# EAGLE design FloppyController1A (EAGLE 7.3.0)
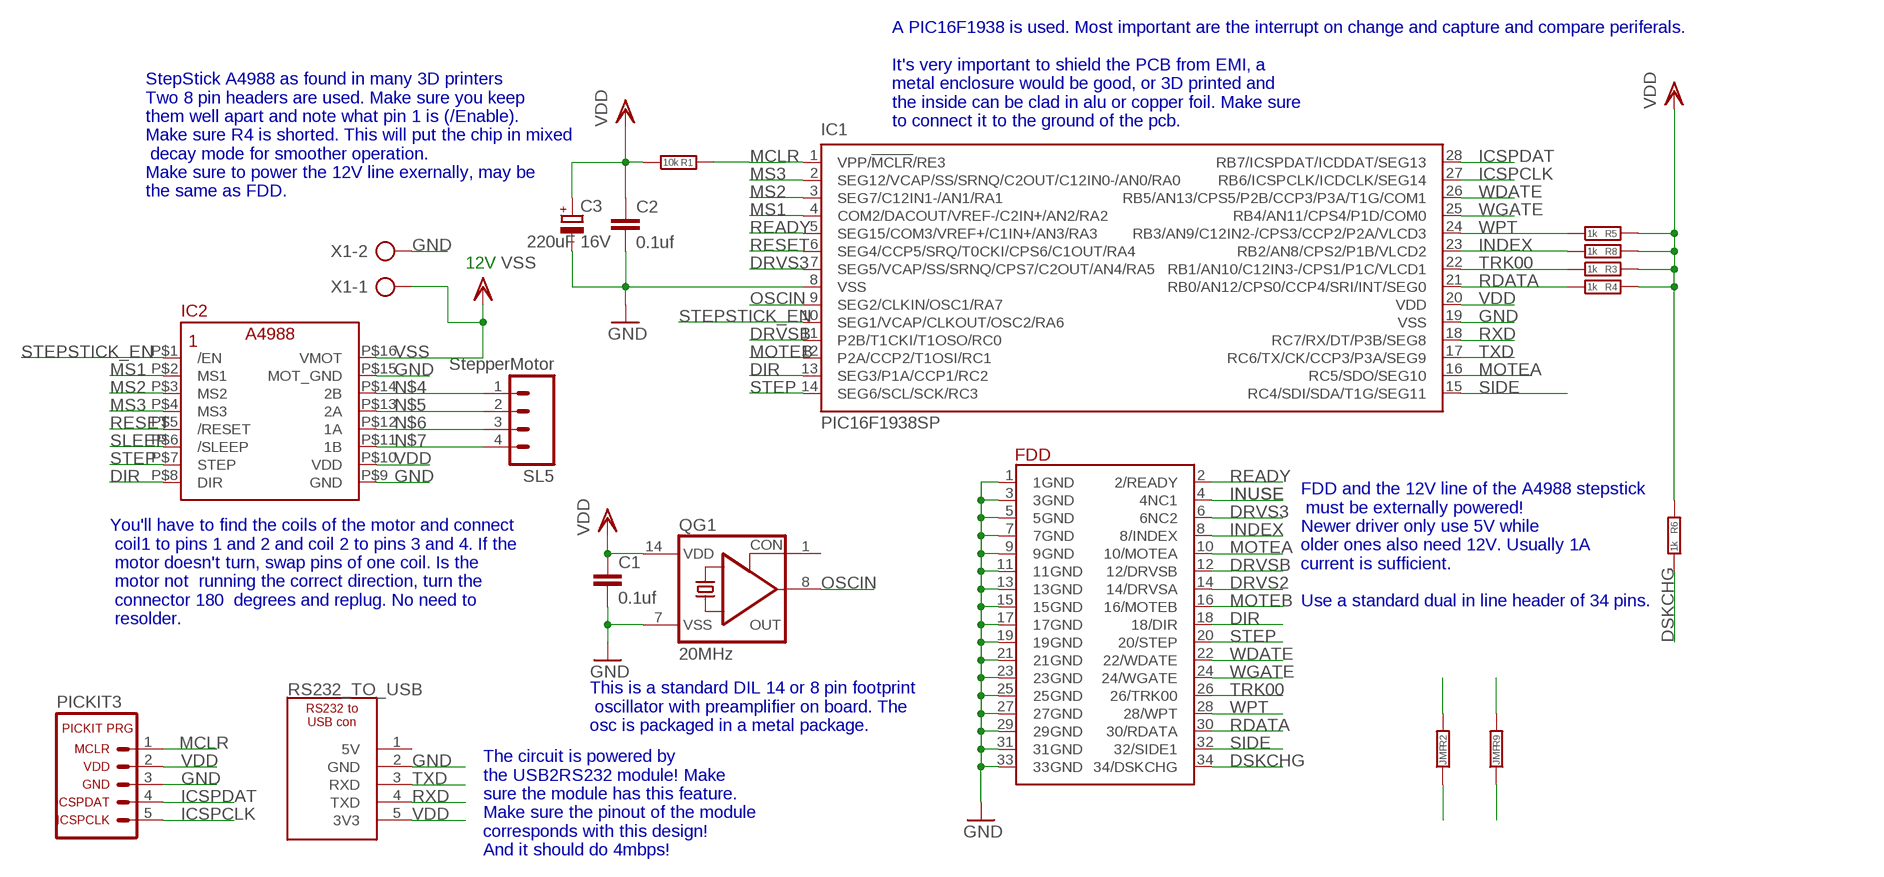
[diagram p0: schematic, sheet 1]

## Parts
C1  0.1uf  C-EUC0805BOTTOM  [C0805TOP]
C2  0.1uf  C-EUC0805BOTTOM  [C0805TOP]
C3  220uF 16V  CPOL-EUE2.5-6  [E2,5-6]
FDD  FLOPPY_34PIN_CONN  [FLOPPY_34PIN_DUALROW]
IC1  PIC16F1938SP  [DIL28-3]
IC2  STEPSTICK_A4988  [STEPSTICK_A4988]
PICKIT3  PICKIT3CONNECTOR  [05P]
QG1  20MHz  CRYSTAL_RES-SG51  [SG51]
R1  10k  R-EU_M1206  [M1206]
R2  JMP  R-EU_M1206  [M1206]
R3  1k  R-EU_M1206  [M1206]
R4  1k  R-EU_M1206  [M1206]
R5  1k  R-EU_M1206  [M1206]
R6  1k  R-EU_M1206  [M1206]
R8  1k  R-EU_M1206  [M1206]
R9  JMP  R-EU_M1206  [M1206]
RS232_TO_USB  RS232_TO_USB_CONNECTOR  [05P]
SL5  StepperMotor  M04  [04P]
X1  AK500/2-H  [AK500/2-H]

## Nets
DIR: FDD.18(18/DIR) IC1.13(SEG3/P1A/CCP1/RC2) IC2.P$8(DIR)
DRVS2: FDD.14(14/DRVSA)
DRVS3: FDD.6(6NC2) IC1.7(SEG5/VCAP/SS/SRNQ/CPS7/C2OUT/AN4/RA5)
DRVSB: FDD.12(12/DRVSB) IC1.11(P2B/T1CKI/T1OSO/RC0)
DSKCHG: FDD.34(34/DSKCHG) R6.1
GND: C1.2 C2.2 C3.- FDD.1(1GND) FDD.3(3GND) FDD.5(5GND) FDD.7(7GND) FDD.9(9GND) FDD.11(11GND) FDD.13(13GND) FDD.15(15GND) FDD.17(17GND) FDD.19(19GND) FDD.21(21GND) FDD.23(23GND) FDD.25(25GND) FDD.27(27GND) FDD.29(29GND) FDD.31(31GND) FDD.33(33GND) IC1.8(VSS) IC1.19(VSS) IC2.P$9(GND) IC2.P$15(MOT_GND) PICKIT3.3(3_GND) QG1.7(VSS) R9.1 R9.2 RS232_TO_USB.2(GND) X1.2
ICSPCLK: IC1.27(RB6/ICSPCLK/ICDCLK/SEG14) PICKIT3.5(5_ICSPCLK)
ICSPDAT: IC1.28(RB7/ICSPDAT/ICDDAT/SEG13) PICKIT3.4(4_ICSPDAT)
INDEX: FDD.8(8/INDEX) IC1.23(RB2/AN8/CPS2/P1B/VLCD2) R8.1
INUSE: FDD.4(4NC1)
MCLR: IC1.1(VPP/!MCLR!/RE3) PICKIT3.1(1_MCLR) R1.2
MOTEA: FDD.10(10/MOTEA) IC1.16(RC5/SDO/SEG10) R2.1 R2.2
MOTEB: FDD.16(16/MOTEB) IC1.12(P2A/CCP2/T1OSI/RC1)
MS1: IC1.4(COM2/DACOUT/VREF-/C2IN+/AN2/RA2) IC2.P$2(MS1)
MS2: IC1.3(SEG7/C12IN1-/AN1/RA1) IC2.P$3(MS2)
MS3: IC1.2(SEG12/VCAP/SS/SRNQ/C2OUT/C12IN0-/AN0/RA0) IC2.P$4(MS3)
N$4: IC2.P$14(2B) SL5.1
N$5: IC2.P$13(2A) SL5.2
N$6: IC2.P$12(1A) SL5.3
N$7: IC2.P$11(1B) SL5.4
OSCIN: IC1.9(SEG2/CLKIN/OSC1/RA7) QG1.8(OUT)
RDATA: FDD.30(30/RDATA) IC1.21(RB0/AN12/CPS0/CCP4/SRI/INT/SEG0) R4.1
READY: FDD.2(2/READY) IC1.5(SEG15/COM3/VREF+/C1IN+/AN3/RA3)
RESET: IC1.6(SEG4/CCP5/SRQ/T0CKI/CPS6/C1OUT/RA4) IC2.P$5(/RESET)
RXD: IC1.18(RC7/RX/DT/P3B/SEG8) RS232_TO_USB.4(TXD)
SIDE: FDD.32(32/SIDE1) IC1.15(RC4/SDI/SDA/T1G/SEG11)
SLEEP: IC2.P$6(/SLEEP)
STEP: FDD.20(20/STEP) IC1.14(SEG6/SCL/SCK/RC3) IC2.P$7(STEP)
STEPSTICK_EN: IC1.10(SEG1/VCAP/CLKOUT/OSC2/RA6) IC2.P$1(/EN)
TRK00: FDD.26(26/TRK00) IC1.22(RB1/AN10/C12IN3-/CPS1/P1C/VLCD1) R3.1
TXD: IC1.17(RC6/TX/CK/CCP3/P3A/SEG9) RS232_TO_USB.3(RXD)
VDD: C1.1 C2.1 C3.+ IC1.20(VDD) IC2.P$10(VDD) PICKIT3.2(2_VDD) QG1.14(VDD) R1.1 R3.2 R4.2 R5.2 R6.2 R8.2 RS232_TO_USB.5(3V3)
VSS: IC2.P$16(VMOT) X1.1
WDATE: FDD.22(22/WDATE) IC1.26(RB5/AN13/CPS5/P2B/CCP3/P3A/T1G/COM1)
WGATE: FDD.24(24/WGATE) IC1.25(RB4/AN11/CPS4/P1D/COM0)
WPT: FDD.28(28/WPT) IC1.24(RB3/AN9/C12IN2-/CPS3/CCP2/P2A/VLCD3) R5.1
Unconnected: QG1.1(CON) RS232_TO_USB.1(5V)

## Notes on the sheet
- A PIC16F1938 is used. Most important are the interrupt on change and capture and compare periferals.
  
  It's very important to shield the PCB from EMI, a
  metal enclosure would be good, or 3D printed and
  the inside can be clad in alu or copper foil. Make sure 
  to connect it to the ground of the pcb.
- StepStick A4988 as found in many 3D printers
  Two 8 pin headers are used. Make sure you keep
  them well apart and note what pin 1 is (/Enable).
  Make sure R4 is shorted. This will put the chip in mixed
   decay mode for smoother operation.
  Make sure to power the 12V line exernally, may be 
  the same as FDD.
- 12V
- FDD and the 12V line of the A4988 stepstick
   must be externally powered!
  Newer driver only use 5V while
  older ones also need 12V. Usually 1A
  current is sufficient. 
  
  Use a standard dual in line header of 34 pins.
- You'll have to find the coils of the motor and connect
   coil1 to pins 1 and 2 and coil 2 to pins 3 and 4. If the
   motor doesn't turn, swap pins of one coil. Is the
   motor not  running the correct direction, turn the
   connector 180  degrees and replug. No need to
   resolder.
- This is a standard DIL 14 or 8 pin footprint
   oscillator with preamplifier on board. The 
  osc is packaged in a metal package.
- The circuit is powered by
  the USB2RS232 module! Make
  sure the module has this feature.
  Make sure the pinout of the module
  corresponds with this design!
  And it should do 4mbps!

## Library data of the parts
C1 C2 = _MyComponents:C-EU: CAPACITOR, European symbol
C3 = _MyComponents:CPOL-EU: POLARIZED CAPACITOR, European symbol
FDD = _MyComponents:FLOPPY_34PIN_CONN
IC1 = microchip:PIC16F19*: Flash-Based, 8-Bit CMOS Microcontrollers wtih LCD Driver and nanoWatt XLP Technology Auto generated by make-symbol-device-package-bsdl.ulp Rev. 33 Source: http://ww1.microchip.com/downloads/en/DeviceDoc/41364D.pdf; MPN: PIC16F1938-I/SP; OC_FARNELL: 1755829; OC_NEWARK: 08R1949
IC2 = _MyComponents:STEPSTICK_A4988
PICKIT3 = _MyComponents:PICKIT3CONNECTOR: PICKIT3 Programmer CONNECTOR; OC_FARNELL: unknown; OC_NEWARK: unknown
QG1 = crystal:CRYSTAL_RES-: CRYSTAL RESONATOR; OC_FARNELL: unknown; OC_NEWARK: unknown
R1-R6 R8 R9 = rcl:R-EU_: RESISTOR, European symbol
RS232_TO_USB = _MyComponents:RS232_TO_USB_CONNECTOR
SL5 = con-amp-quick:M04: AMP QUICK CONNECTOR; OC_FARNELL: unknown; OC_NEWARK: unknown
X1 = con-ptr500:AK500/2-H: CONNECTOR Aug. 2004 / PTR Meßtechnik: Die Bezeichnung der Serie AK505 wurde geändert. Es handelt sich hierbei um AK500 in horizontaler Ausführung.; OC_FARNELL: unknown; OC_NEWARK: unknown

## Board
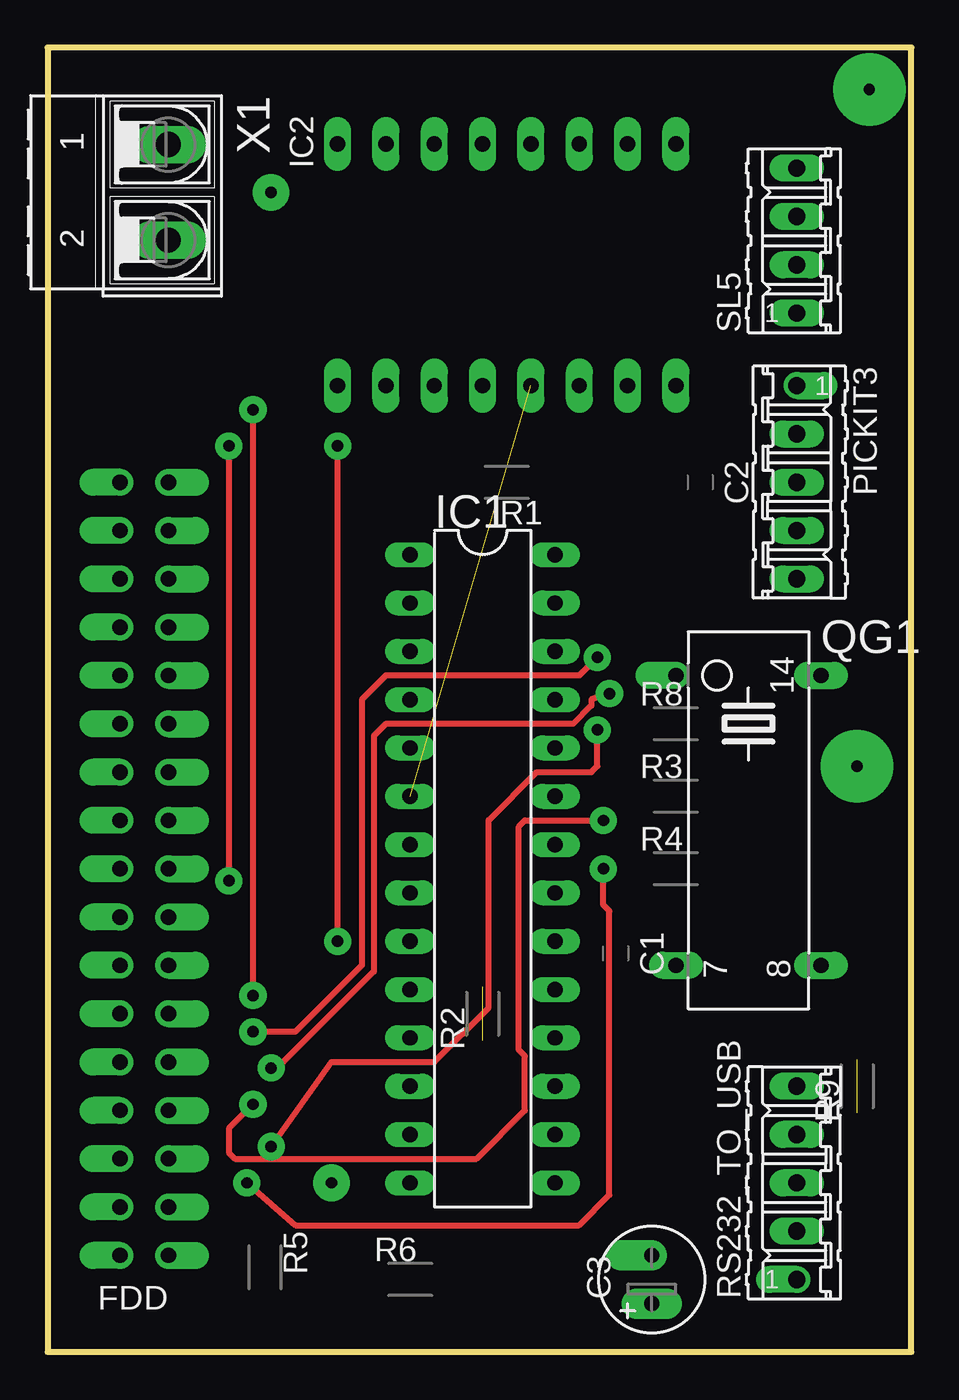
[diagram p1: board, top side]
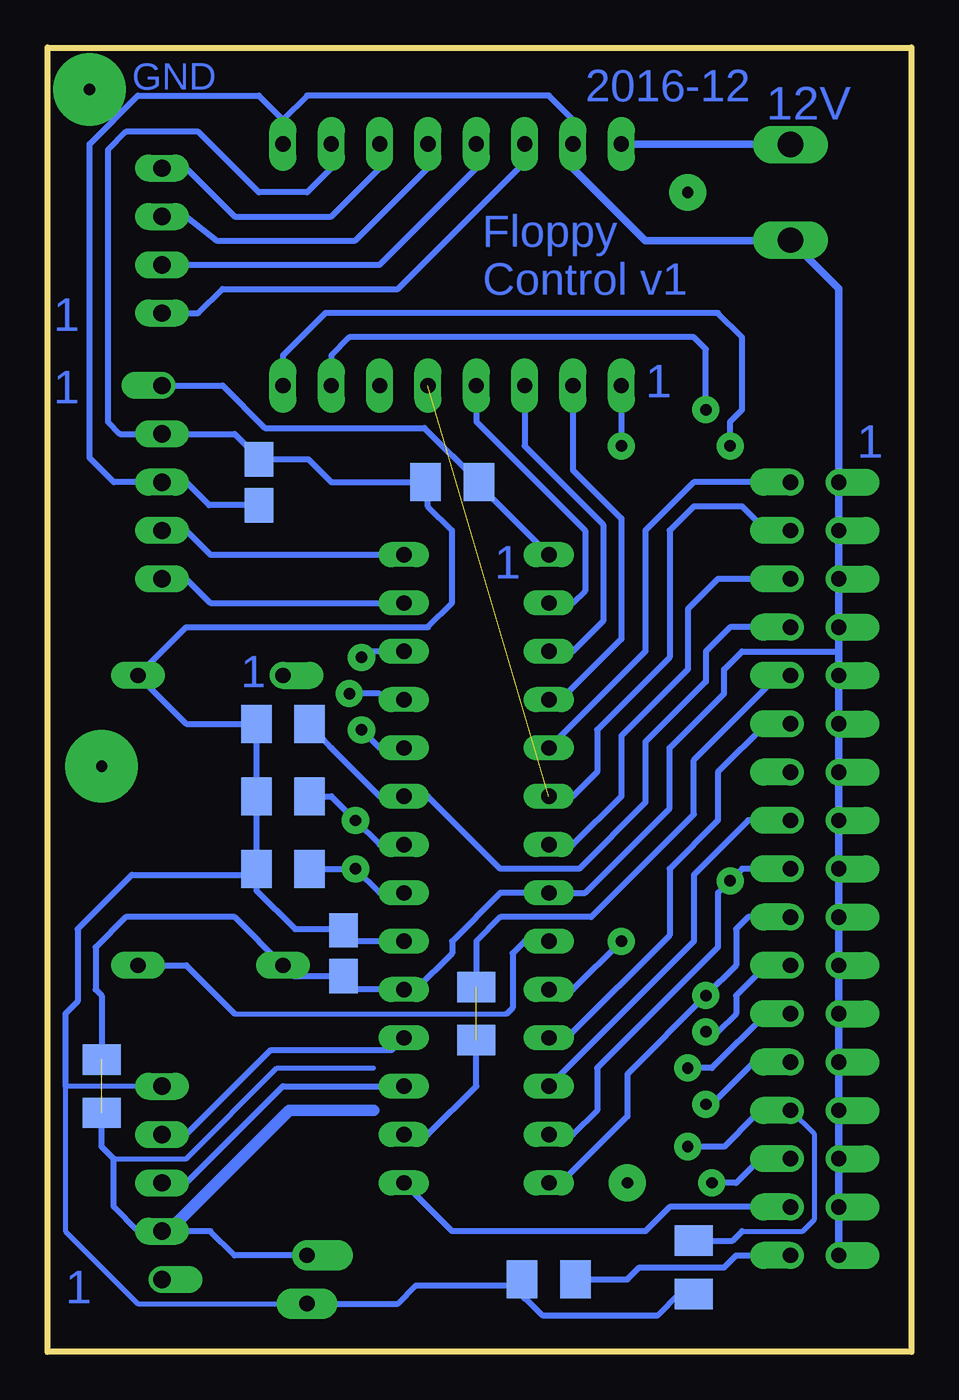
[diagram p2: board, bottom side, seen from below]

Size 45.39 x 68.57 mm. Coordinates in mm from the lower left corner, seen from the top.
Outline: 0,0 45.39,0 45.39,68.57 0,68.57 0,0
Copper layers (1*16): Top 0.035mm / dielectric 1.5mm / Bottom 0.035mm
Design rules "default": minimum track width 14mil, minimum drill 24mil, track to track 14mil, track to pad 14mil, pad to pad 14mil, via to via 14mil, smd to smd 14mil, copper to edge 40mil, drill to drill 8mil, minimum pad ring 10mil, minimum via ring 8mil, stop-mask expansion 4mil, vias tented up to drill 0mil, thermal gap 10mil

### Footprints (pad centres in the part's own frame; a part is rotated, then mirrored left to right if it is on the bottom)
C0805TOP = smd 1.808 x 1.5 bottom: 1 -1.204,0; 2 1.204,0
E2,5-6 = drill 0.813 pad 1.6 long: + -1.27,0 | drill 0.813 pad 1.6 offset: - 1.27,0
FLOPPY_34PIN_DUALROW = drill 0.8 pad 1.422 offset: 1 0,0; 2 2.54,0; 3 0,-2.54; 4 2.54,-2.54; 5 0,-5.08; 6 2.54,-5.08; 7 0,-7.62; 8 2.54,-7.62; 9 0,-10.16; 10 2.54,-10.16; 11 0,-12.7; 12 2.54,-12.7; 13 0,-15.24; 14 2.54,-15.24; 15 0,-17.78; 16 2.54,-17.78; 17 0,-20.32; 18 2.54,-20.32; 19 0,-22.86; 20 2.54,-22.86; 21 0,-25.4; 22 2.54,-25.4; 23 0,-27.94; 24 2.54,-27.94; 25 0,-30.48; 26 2.54,-30.48; 27 0,-33.02; 28 2.54,-33.02; 29 0,-35.56; 30 2.54,-35.56; 31 0,-38.1; 32 2.54,-38.1; 33 0,-40.64; 34 2.54,-40.64
DIL28-3 = drill 0.813 long: 1 -16.51,-3.81; 2 -13.97,-3.81; 3 -11.43,-3.81; 4 -8.89,-3.81; 5 -6.35,-3.81; 6 -3.81,-3.81; 7 -1.27,-3.81; 8 1.27,-3.81; 9 3.81,-3.81; 10 6.35,-3.81; 11 8.89,-3.81; 12 11.43,-3.81; 13 13.97,-3.81; 14 16.51,-3.81; 15 16.51,3.81; 16 13.97,3.81; 17 11.43,3.81; 18 8.89,3.81; 19 6.35,3.81; 20 3.81,3.81; 21 1.27,3.81; 22 -1.27,3.81; 23 -3.81,3.81; 24 -6.35,3.81; 25 -8.89,3.81; 26 -11.43,3.81; 27 -13.97,3.81; 28 -16.51,3.81
STEPSTICK_A4988 = drill 0.8 pad 1.422 long: P$1 0,0; P$2 0,-2.54; P$3 0,-5.08; P$4 0,-7.62; P$5 0,-10.16; P$6 0,-12.7; P$7 0,-15.24; P$8 0,-17.78; P$9 12.7,-17.78; P$10 12.7,-15.24; P$11 12.7,-12.7; P$12 12.7,-10.16; P$13 12.7,-7.62; P$14 12.7,-5.08; P$15 12.7,-2.54; P$16 12.7,0
05P = drill 0.914 offset: 1 -5.08,0 | drill 0.914 long: 2 -2.54,0; 3 0,0; 4 2.54,0; 5 5.08,0
SG51 = drill 0.813 pad 1.422 offset: 1 -7.62,-3.81 | drill 0.813 pad 1.422 long: 7 7.62,-3.81; 8 7.62,3.81; 14 -7.62,3.81
M1206 = smd 1.6 x 2 bottom: 1 -1.4,0; 2 1.4,0
04P = drill 0.914 long: 1 -3.81,0; 2 -1.27,0; 3 1.27,0; 4 3.81,0
AK500/2-H = drill 1.321 long: 1 -2.515,0; 2 2.515,0

### Placement (x,y rotation side)
C1  29.84,20.95 270 top
C2  34.29,45.72 270 top
C3  31.75,3.81 90 top
FDD  3.81,45.72 0 top
IC1  22.86,25.4 270 top
IC2  15.24,50.8 90 top
PICKIT3  39.37,45.72 270 top
QG1  36.83,27.94 270 top
R1  24.13,45.72 180 top
R2  22.86,17.78 90 top
R3  33.02,29.21 0 top
R4  33.02,25.4 0 top
R5  11.43,4.45 270 top
R6  19.05,3.81 0 top
R8  33.02,33.02 0 top
R9  42.55,13.97 90 top
RS232_TO_USB  39.37,8.89 90 top
SL5  39.37,58.42 90 top
X1  6.35,60.96 270 top

### Tracks (layer width: path | path; a pad name or v marks a point on that pad's centre or on a via)
DIR  (via drill 0.6 pad 1.42)
  Top 0.305: v9.52,47.62 v9.52,24.77
  Bottom 0.305: FDD.18 8.89,25.4 v9.52,24.77 10.16,24.13 10.16,21.27 16.51,14.92 16.51,12.7 17.78,11.43 IC1.13 | v9.52,47.62 9.52,48.9 8.89,49.53 8.89,53.34 10.16,54.61 30.8,54.61 33.02,52.39 IC2.P$8
DRVS3
  Bottom 0.305: FDD.6 10.16,40.64 11.75,39.05 11.75,35.88 15.24,32.39 15.24,29.21 17.78,26.67 IC1.7
DRVSB
  Bottom 0.305: IC1.11 18.1,16.51 12.7,21.91 12.7,25.4 10.16,27.94 10.16,30.48 7.62,33.02 FDD.12
DSKCHG
  Bottom 0.305: R6.1 14.92,3.81 14.29,4.45 9.84,4.45 9.21,5.08 FDD.34
GND  (2 unrouted)
  Bottom 0.254: 41.91,10.16 38.1,10.16 33.34,14.92 28.26,14.92
  Bottom 0.305: IC2.P$15 17.78,64.77 19.05,66.04 31.75,66.04 33.02,64.77 | 33.02,64.77 IC2.P$9 | C2.2 36.9,44.52 38.1,45.72 PICKIT3.3 41.91,45.72 43.18,46.99 43.18,63.5 40.64,66.04 34.29,66.04 33.02,64.77 | 3.81,36.83 8.89,36.83 9.84,35.88 9.84,34.61 12.7,31.75 12.7,28.58 17.15,24.13 IC1.8 21.59,24.13 24.13,21.59 24.13,20.95 26.03,19.05 IC1.19 30.41,19.05 C1.2 32.45,19.75 QG1.7 35.56,22.86 41.28,22.86 42.86,21.27 42.86,19.05 42.55,18.73 42.55,15.24 | C3.- 35.56,5.08 36.83,6.35 RS232_TO_USB.2 40.64,6.35 41.91,7.62 41.91,10.16 42.55,10.79 R9.1
  Bottom 0.406: FDD.1 3.68,45.72 | FDD.1 FDD.3 FDD.5 FDD.7 3.81,36.83 FDD.9 FDD.11 FDD.13 FDD.15 FDD.17 FDD.19 FDD.21 FDD.23 FDD.25 FDD.27 FDD.29 FDD.31 FDD.33 | IC2.P$15 17.78,62.23 13.97,58.42 6.38,58.42 X1.2 3.81,55.91 FDD.1
  Bottom 0.61: RS232_TO_USB.2 39.05,6.35 32.7,12.7 28.26,12.7
ICSPCLK
  Bottom 0.305: PICKIT3.5 38.1,40.64 36.83,39.37 IC1.27
ICSPDAT
  Bottom 0.305: PICKIT3.4 38.1,43.18 36.83,41.91 IC1.28
INDEX
  Bottom 0.305: FDD.8 9.52,38.1 10.8,36.83 10.8,35.24 13.97,32.07 13.97,28.89 17.46,25.4 21.59,25.4 25.4,29.21 IC1.23 27.94,29.21 30.48,31.75 R8.1
INUSE
  Bottom 0.305: FDD.4 7.62,43.18 8.89,44.45 11.43,44.45 12.7,43.18 12.7,36.51 16.51,32.7 16.51,30.48 17.78,29.21
MCLR
  Bottom 0.305: IC1.1 22.73,45.59 R1.2 25.59,48.58 33.97,48.58 36.19,50.8 PICKIT3.1
MOTEA  (1 unrouted)
  Bottom 0.305: IC1.16 25.4,11.43 22.86,13.97 R2.1 | FDD.10 6.98,35.56 11.43,31.12 11.43,28.26 16.83,22.86 21.59,22.86 22.86,21.59 R2.2
MOTEB
  Bottom 0.305: FDD.16 8.57,27.94 11.43,25.08 11.43,21.59 IC1.12
MS1
  Bottom 0.305: IC2.P$2 17.78,46.36 15.24,43.82 15.24,37.47 18.1,34.61 IC1.4
MS2
  Bottom 0.305: IC2.P$3 20.32,47.62 16.19,43.5 16.19,38.42 17.78,36.83 IC1.3
MS3
  Bottom 0.305: IC2.P$4 22.86,48.9 17.15,43.18 17.15,40.01 17.78,39.37 IC1.2
N$1  (via drill 0.6 pad 3.81)
  other vias: 43.18,66.36
N$2  (via drill 0.6 pad 1.93)
  other vias: 11.75,60.96
N$3  (via drill 0.6 pad 1.93)
  other vias: 14.92,8.89
N$4
  Bottom 0.305: SL5.1 37.47,54.61 36.19,55.88 26.99,55.88 20.32,62.55 IC2.P$14
N$5
  Bottom 0.305: SL5.2 27.94,57.15 22.86,62.23 IC2.P$13
N$6
  Bottom 0.305: SL5.3 38.1,59.69 36.51,58.42 29.21,58.42 25.4,62.23 IC2.P$12
N$7
  Bottom 0.305: SL5.4 38.1,62.23 35.56,59.69 30.48,59.69 27.94,62.23 IC2.P$11
N$8  (via drill 0.6 pad 3.81)
  other vias: 42.55,30.8
OSCIN
  Bottom 0.254: 35.56,17.78 21.27,17.78
  Bottom 0.305: QG1.8 38.1,20.32 35.56,17.78 | 21.27,17.78 20.95,18.1 20.95,20.95 20.32,21.59 IC1.9
RDATA  (via drill 0.6 pad 1.42)
  Top 0.305: v10.48,8.89 13.02,6.67 27.94,6.67 29.53,8.26 29.53,23.18 29.21,23.49 v29.21,25.4
  Bottom 0.305: R4.1 v29.21,25.4 27.94,24.13 IC1.21 | FDD.30 6.67,9.84 8.26,9.84 9.21,8.89 v10.48,8.89
READY
  Bottom 0.305: 6.48,45.72 11.43,45.72 13.97,43.18 13.97,36.83 IC1.5
  Bottom 0.406: FDD.2 6.48,45.72
RESET  (1 unrouted)
RXD
  Bottom 0.305: RS232_TO_USB.4 38.1,11.43 33.66,15.87 27.3,15.87 IC1.18
SIDE
  Bottom 0.305: FDD.32 12.7,7.62 13.97,6.35 24.13,6.35 IC1.15
STEP  (via drill 0.6 pad 1.42)
  Top 0.305: v10.8,49.53 v10.8,18.73
  Bottom 0.305: FDD.20 8.57,22.86 9.21,22.23 9.21,20.32 v10.8,18.73 14.92,14.6 14.92,12.38 18.41,8.89 IC1.14 | v10.8,49.53 10.8,52.7 11.43,53.34 29.53,53.34 30.48,52.39 IC2.P$7
STEPSTICK_EN  (via drill 0.6 pad 1.42)
  Top 0.305: v15.24,21.59 v15.24,47.62
  Bottom 0.305: IC2.P$1 v15.24,47.62 | v15.24,21.59 17.78,19.05 IC1.10
TRK00  (via drill 0.6 pad 1.42)
  Top 0.305: v10.8,13.02 9.52,11.75 9.52,10.48 9.84,10.16 22.54,10.16 25.08,12.7 25.08,15.56 24.77,15.87 24.77,27.62 25.08,27.94 v29.21,27.94
  Bottom 0.305: R3.1 30.48,29.21 v29.21,27.94 27.94,26.67 IC1.22 | FDD.26 8.26,15.24 10.48,13.02 v10.8,13.02
TXD
  Bottom 0.305: RS232_TO_USB.3 38.1,8.89 33.02,13.97 IC1.17
VDD
  Bottom 0.254: RS232_TO_USB.5 44.45,13.97 44.45,6.35 40.64,2.54 C3.+
  Bottom 0.305: IC2.P$10 30.48,62.23 31.75,60.96 34.29,60.96 37.47,64.14 41.28,64.14 42.23,63.18 42.23,48.9 41.59,48.26 PICKIT3.2 35.56,48.26 34.29,46.99 C2.1 31.68,46.92 30.48,45.72 R1.1 25.4,45.59 25.4,44.45 24.13,43.18 24.13,39.37 25.4,38.1 38.1,38.1 QG1.14 38.1,33.02 R8.2 R3.2 R4.2 | R4.2 34.42,24.26 32.39,22.23 29.91,22.23 C1.1 | 29.91,21.91 C1.1 | R4.2 34.61,25.21 34.92,25.08 40.96,25.08 43.81,22.23 43.81,18.41 44.45,17.78 44.45,13.97 | IC1.20 29.78,21.59 C1.1 | R6.2 20.77,3.49 26.03,3.49 26.99,2.54 C3.+ 33.02,2.54 | 12.2,3.04 13.34,1.91 19.37,1.91 20.32,2.86
  Bottom 0.406: R5.2 12.2,3.04 | 20.32,2.86 20.32,3.68 R6.2
VSS
  Bottom 0.406: IC2.P$16 6.38,63.5 X1.1
WDATE  (via drill 0.6 pad 1.42)
  Top 0.305: v28.89,36.51 27.94,35.56 17.78,35.56 16.51,34.29 16.51,20.32 13.02,16.83 v10.8,16.83
  Bottom 0.305: IC1.26 28.58,36.83 v28.89,36.51 | FDD.22 7.62,20.32 9.21,18.73 9.21,17.78 10.16,16.83 v10.8,16.83
WGATE  (via drill 0.6 pad 1.42)
  Top 0.305: v29.53,34.61 28.58,34.29 28.58,33.97 27.62,33.02 17.78,33.02 17.15,32.39 17.15,20 12.06,14.92 v11.75,14.92
  Bottom 0.305: IC1.25 27.62,34.29 27.94,34.61 v29.53,34.61 | FDD.24 7.62,17.78 10.48,14.92 v11.75,14.92
WPT  (via drill 0.6 pad 1.42)
  Top 0.305: v11.75,10.79 14.92,15.24 20.32,15.24 23.18,18.1 23.18,27.94 25.72,30.48 28.58,30.48 28.89,30.8 v28.89,32.7
  Bottom 0.254: 8.89,6.35 5.72,6.35 5.08,6.98 5.08,11.43 FDD.28
  Bottom 0.305: IC1.24 27.94,31.75 v28.89,32.7 | FDD.28 6.67,12.38 8.26,12.38 9.84,10.79 v11.75,10.79 | R5.1 9.4,5.85 8.89,6.35

### Text on the board
Bottom: 2016-12 | GND | 12V | Floppy / Control v1 | 1 | 1 | 1 | 1 | 1 | 1 | 1